# Altium schematic sheet ESP32 with USBC.SchDoc
size A2; SheetNumber: 1; SheetTotal: 1
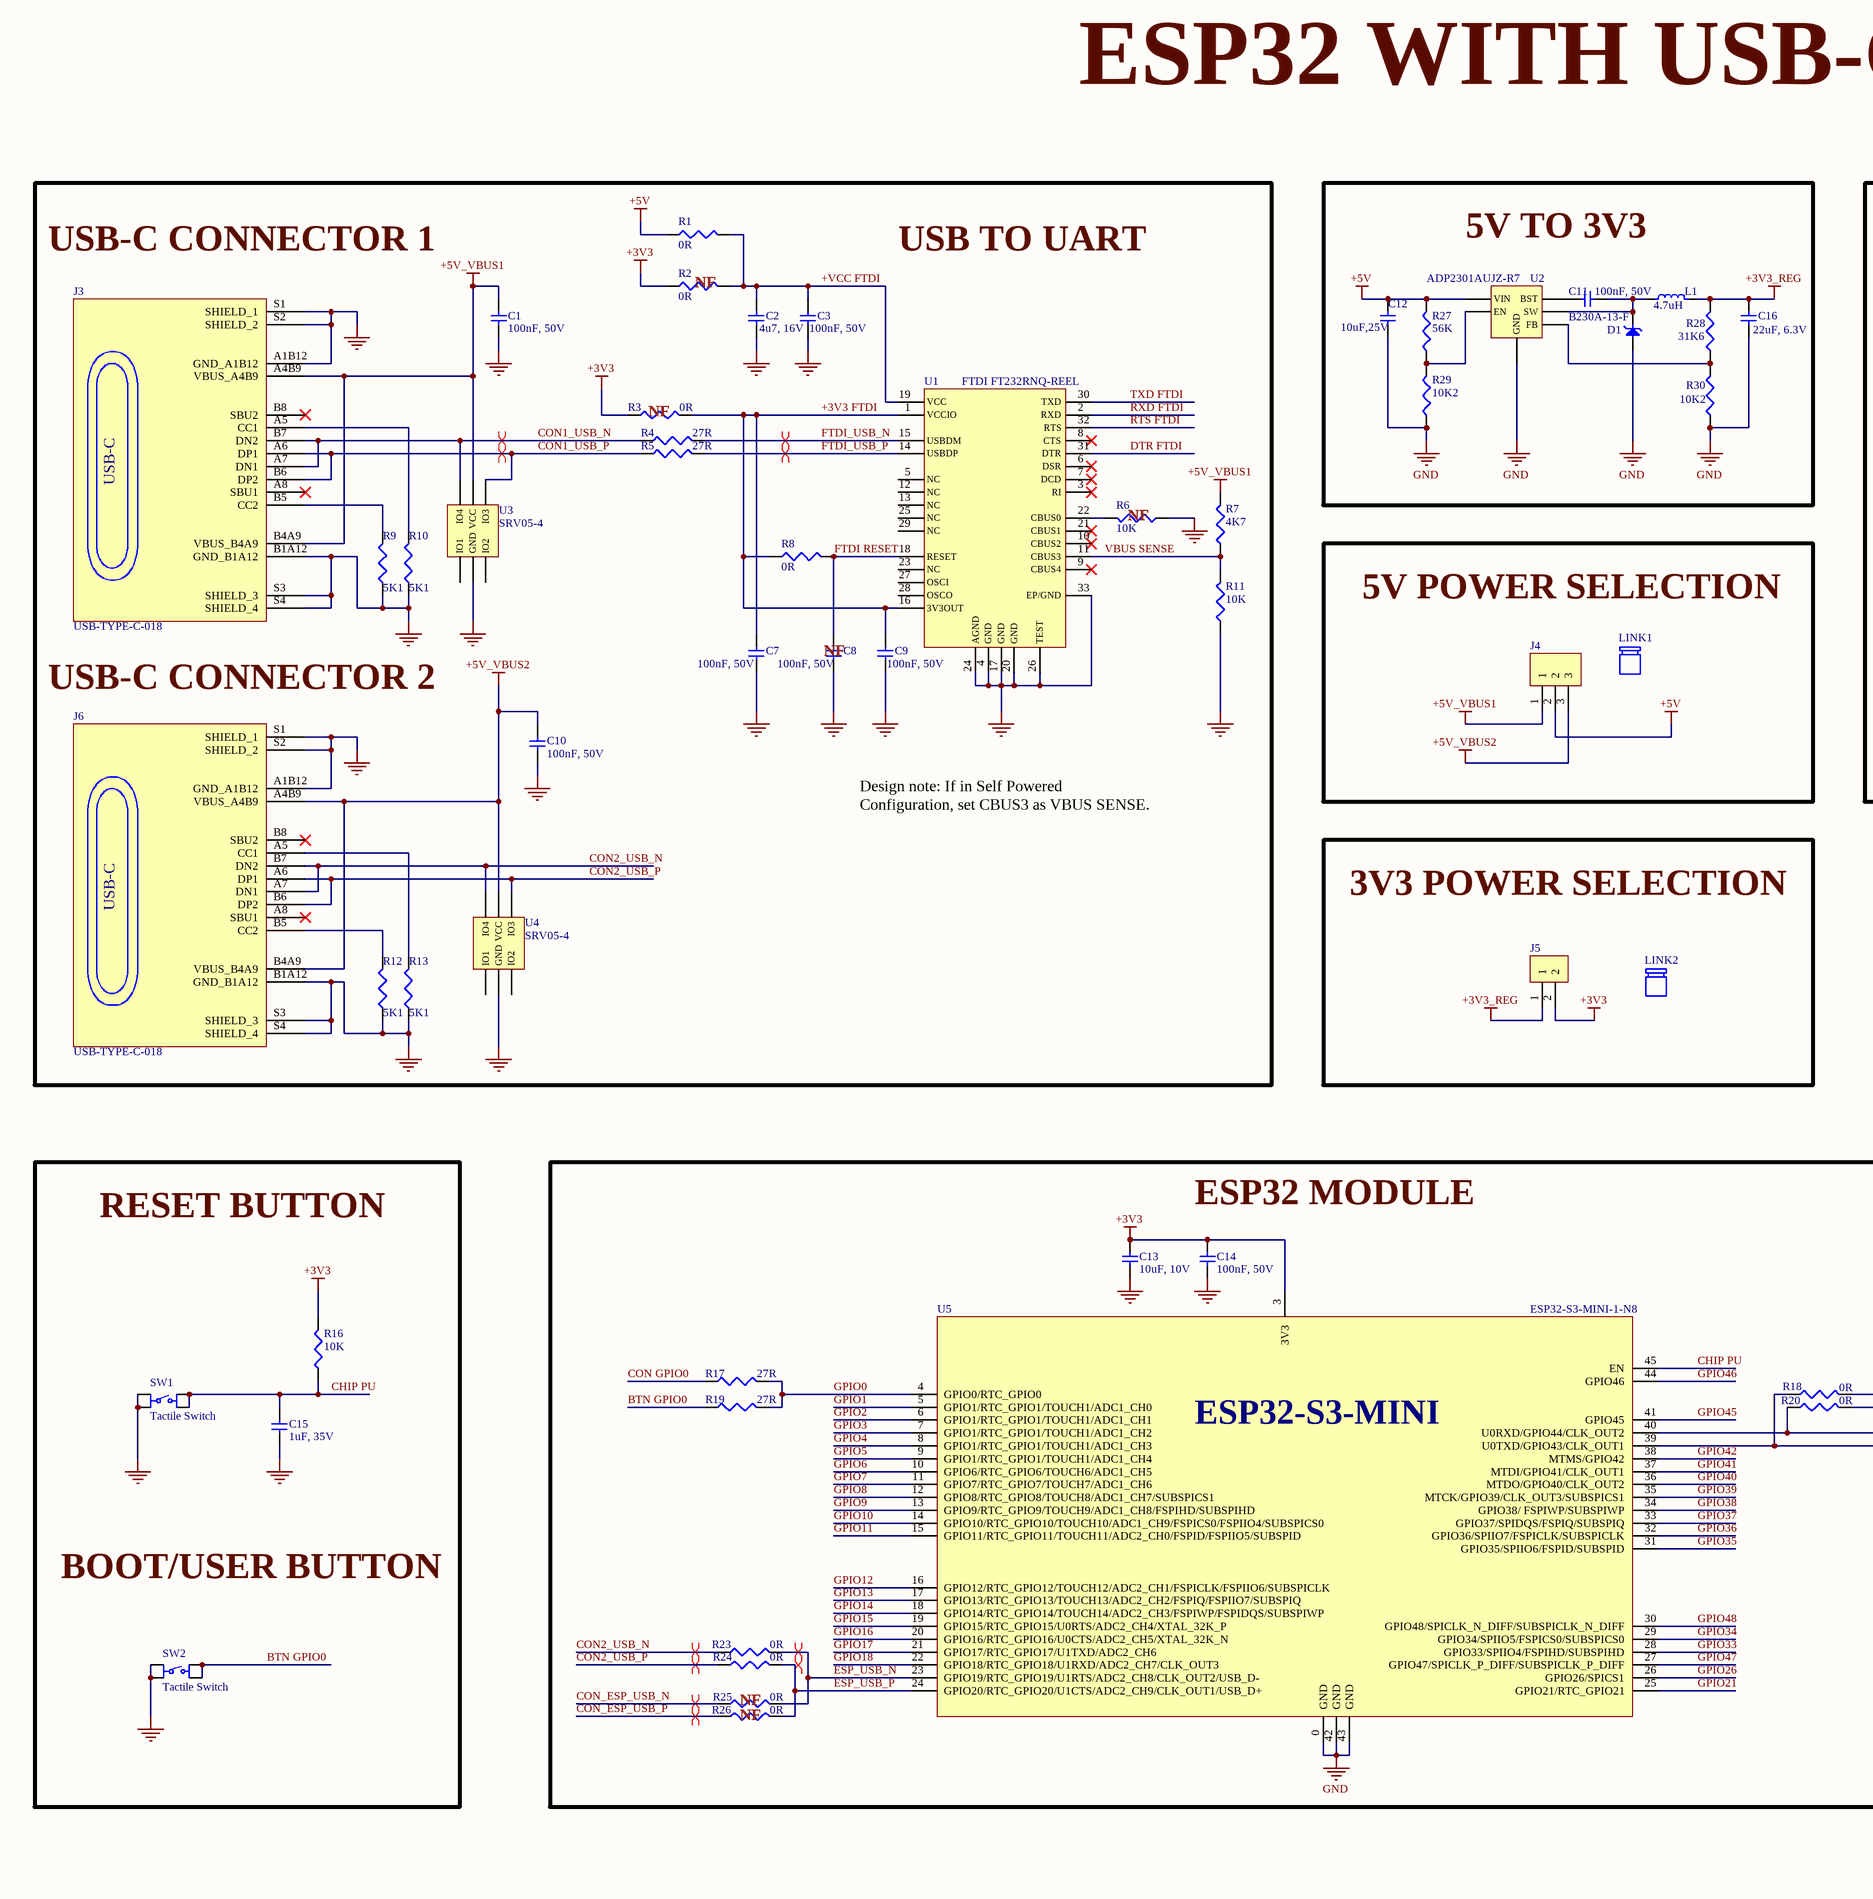
[diagram p0: ESP32 with USBC.SchDoc, left]
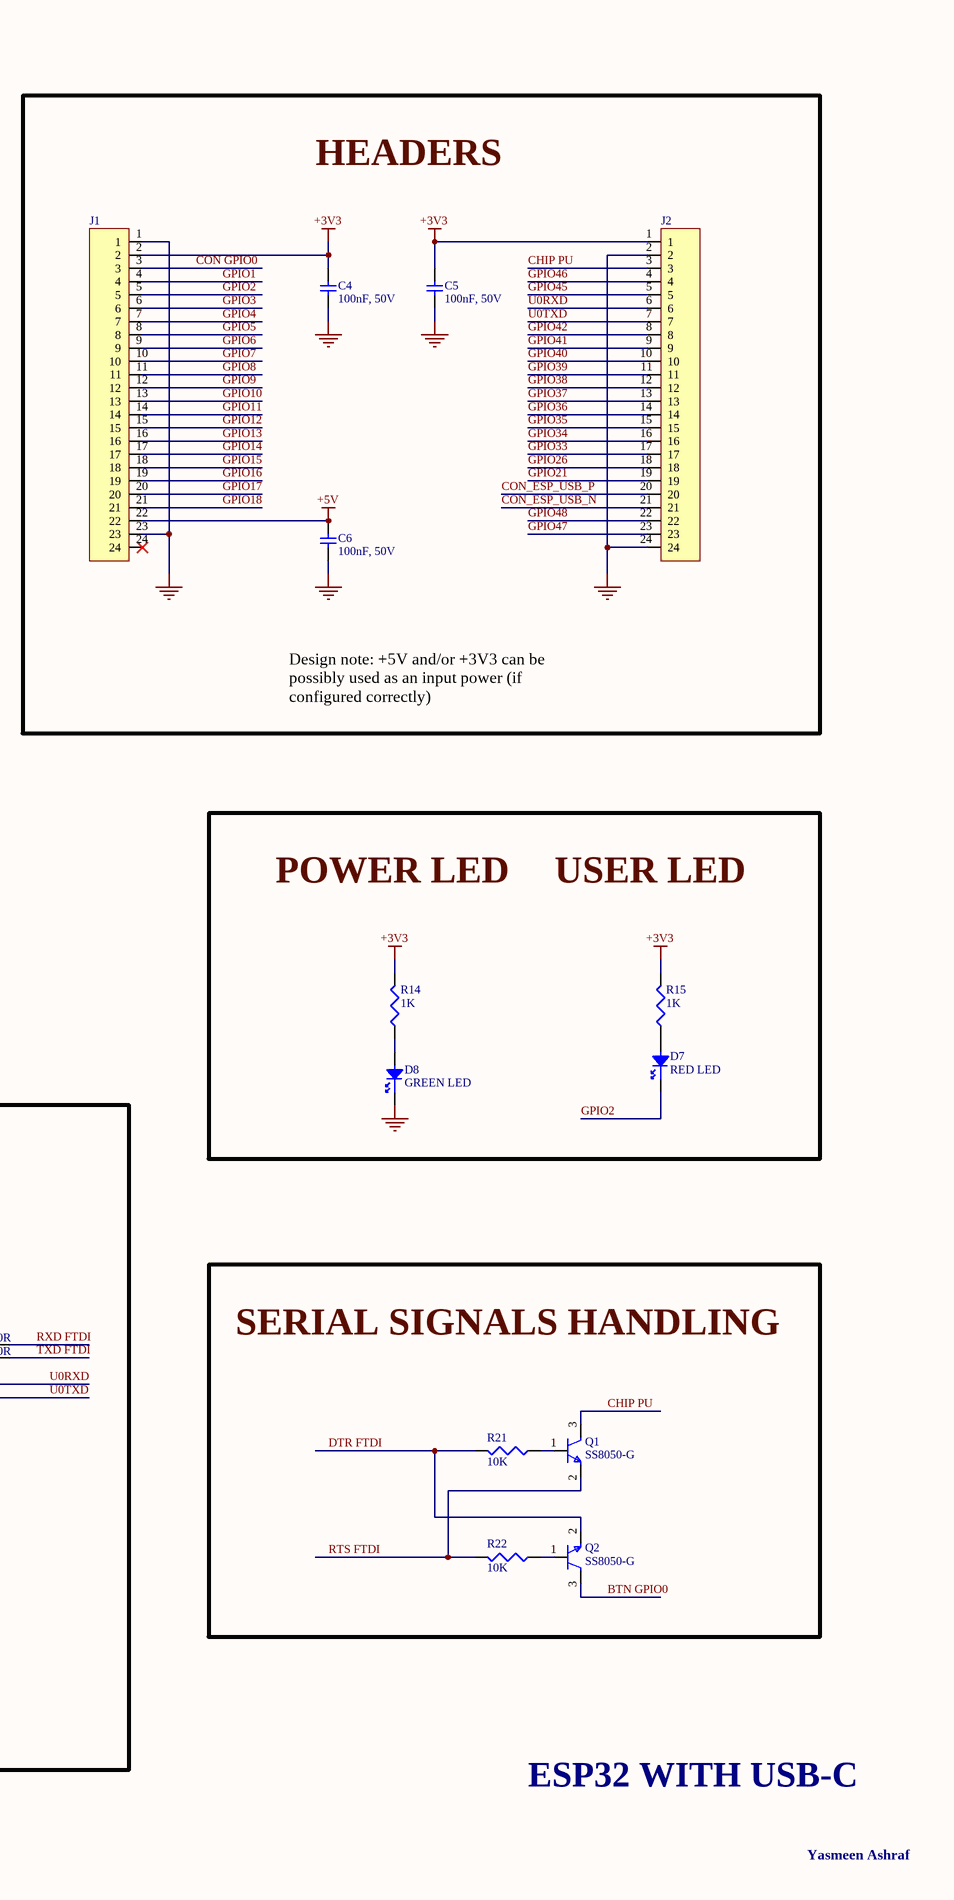
[diagram p1: ESP32 with USBC.SchDoc, right]

## Parts
C1  100nF, 50V  [Capacitor]
C2  4u7, 16V  [Capacitor]
C3  100nF, 50V  [Capacitor]
C4  100nF, 50V  [Capacitor]
C5  100nF, 50V  [Capacitor]
C6  100nF, 50V  [Capacitor]
C7  100nF, 50V  [Capacitor]
C8  100nF, 50V  [Capacitor]
C9  100nF, 50V  [Capacitor]
C10  100nF, 50V  [Capacitor]
C11  100nF, 50V  [Capacitor]
C12  10uF,25V  [CL10A106MA8NRNC]
C13  10uF, 10V  [Capacitor]
C14  100nF, 50V  [Capacitor]
C15  1uF, 35V  [Capacitor]
C16  22uF, 6.3V  [Capacitor]
D1  B230A-13-F  [Schottky Diode]
D7  RED LED  [RED LED]
D8  GREEN LED  [GREEN LED]
J1  X6511WV-24H-C60D30  [HDR_1x24]  (value not drawn)
J2  X6511WV-24H-C60D30  [HDR_1x24]  (value not drawn)
J3  USB-TYPE-C-018  [USB-TYPE-C-018]
J4  TSW-103-14-G-S  [TSW-103-14-G-S]  (value not drawn)
J5  22284020  [HDR_1x2]  (value not drawn)
J6  USB-TYPE-C-018  [USB-TYPE-C-018]
L1  4.7uH  [Inductor]
LINK1  M50-1900005  (value not drawn)  (mechanical)
LINK2  M50-1900005  (value not drawn)  (mechanical)
Q1  SS8050-G  [SS8050-G]
Q2  SS8050-G  [SS8050-G]
R1  0R  [RC0402]
R2  0R  [RC0402]
R3  0R  [RC0402]
R4  27R  [RC0402]
R5  27R  [RC0402]
R6  10K  [AC0402]
R7  4K7  [RC0402]
R8  0R  [RC0402]
R9  5K1  [RC0402]
R10  5K1  [RC0402]
R11  10K  [AC0402]
R12  5K1  [RC0402]
R13  5K1  [RC0402]
R14  1K  [RC0402]
R15  1K  [RC0402]
R16  10K  [AC0402]
R17  27R  [RC0402]
R18  0R  [RC0402]
R19  27R  [RC0402]
R20  0R  [RC0402]
R21  10K  [AC0402]
R22  10K  [AC0402]
R23  0R  [RC0402]
R24  0R  [RC0402]
R25  0R  [RC0402]
R26  0R  [RC0402]
R27  56K  [RC0402]
R28  31K6  [AC0402]
R29  10K2  [RC0402]
R30  10K2  [RC0402]
SW1  Tactile Switch  [Tactile Switch]
SW2  Tactile Switch  [Tactile Switch]
U1  FTDI FT232RNQ-REEL  [FTDI FT232RNQ-REEL]
U2  ADP2301AUJZ-R7  [BUCK]
U3  SRV05-4  [SRV05-4]
U4  SRV05-4  [SRV05-4]
U5  ESP32-S3-MINI-1-N8  [ESP32-S3-MINI-1-N8]

## Blocks framed on the sheet
5V TO 3V3: C11 C12 C16 D1 L1 R27-R30 U2
HEADERS: C4-C6 J1 J2
5V POWER SELECTION: J4 LINK1
3V3 POWER SELECTION: J5 LINK2
ESP32 MODULE: C13 C14 R17-R20 R23-R26 U5
SERIAL SIGNALS HANDLING: Q1 Q2 R21 R22

## Nets
+3V3: C4.2 C5.2 C13.2 C14.2 J1.2 J2.1 J5.2 R2.1 R3.1 R14.2 R15.2 R16.2 U5.3(3V3)
+3V3_REG: C16.2 J5.1 L1.2 R28.2
+5V: C6.2 C12.2 J1.22 J4.2 R1.1 R27.2 U2.5(VIN)
+5V_VBUS1: C1.2 J3.A4B9(VBUS_A4B9) J3.B4A9(VBUS_B4A9) J4.1 R7.2 U3.5(VCC)
+5V_VBUS2: C10.2 J4.3 J6.A4B9(VBUS_A4B9) J6.B4A9(VBUS_B4A9) U4.5(VCC)
GND: C1.1 C2.1 C3.1 C4.1 C5.1 C6.1 C7.1 C8.1 C9.1 C10.1 C12.1 C13.1 C14.1 C15.1 C16.1 D1.A D8.1 J1.1 J1.23 J2.2 J2.24 J3.A1B12(GND_A1B12) J3.B1A12(GND_B1A12) J3.S1(SHIELD_1) J3.S2(SHIELD_2) J3.S3(SHIELD_3) J3.S4(SHIELD_4) J6.A1B12(GND_A1B12) J6.B1A12(GND_B1A12) J6.S1(SHIELD_1) J6.S2(SHIELD_2) J6.S3(SHIELD_3) J6.S4(SHIELD_4) R6.1 R9.1 R10.1 R11.1 R12.1 R13.1 R29.1 R30.1 SW1.3 SW1.4 SW2.3 SW2.4 U1.4(GND) U1.17(GND) U1.20(GND) U1.24(AGND) U1.26(TEST) U1.33(EP/GND) U2.2(GND) U3.2(GND) U4.2(GND) U5.0(GND) U5.42(GND) U5.43(GND)
+3V3 FTDI: C7.2 C9.2 R3.2 R8.1 U1.1(VCCIO) U1.16(3V3OUT)
+VCC FTDI: C2.2 C3.2 R1.2 R2.2 U1.19(VCC)
BTN GPIO0: Q2.3 R19.1 SW2.1 SW2.2
CHIP PU: C15.2 J2.3 Q1.3 R16.1 SW1.1 SW1.2 U5.45(EN)
CON1_USB_N: J3.A7(DN1) J3.B7(DN2) R4.1 U3.6(IO4)
CON1_USB_P: J3.A6(DP1) J3.B6(DP2) R5.1 U3.4(IO3)
CON2_USB_N: J6.A7(DN1) J6.B7(DN2) R23.1 U4.6(IO4)
CON2_USB_P: J6.A6(DP1) J6.B6(DP2) R24.1 U4.4(IO3)
CON GPIO0: J1.3 R17.1
CON_ESP_USB_N: J2.21 R25.1
CON_ESP_USB_P: J2.20 R26.1
DTR FTDI: Q2.2 R21.2 U1.31(DTR)
ESP_USB_N: R23.2 R25.2 U5.23(GPIO19/RTC_GPIO19/U1RTS/ADC2_CH8/CLK_OUT2/USB_D-)
ESP_USB_P: R24.2 R26.2 U5.24(GPIO20/RTC_GPIO20/U1CTS/ADC2_CH9/CLK_OUT1/USB_D+)
FTDI RESET: C8.2 R8.2 U1.18(RESET)
FTDI_USB_N: R4.2 U1.15(USBDM)
FTDI_USB_P: R5.2 U1.14(USBDP)
GPIO0: R17.2 R19.2 U5.4(GPIO0/RTC_GPIO0)
GPIO1: J1.4 U5.5(GPIO1/RTC_GPIO1/TOUCH1/ADC1_CH0)
GPIO2: D7.1 J1.5 U5.6(GPIO1/RTC_GPIO1/TOUCH1/ADC1_CH1)
GPIO3: J1.6 U5.7(GPIO1/RTC_GPIO1/TOUCH1/ADC1_CH2)
GPIO4: J1.7 U5.8(GPIO1/RTC_GPIO1/TOUCH1/ADC1_CH3)
GPIO5: J1.8 U5.9(GPIO1/RTC_GPIO1/TOUCH1/ADC1_CH4)
GPIO6: J1.9 U5.10(GPIO6/RTC_GPIO6/TOUCH6/ADC1_CH5)
GPIO7: J1.10 U5.11(GPIO7/RTC_GPIO7/TOUCH7/ADC1_CH6)
GPIO8: J1.11 U5.12(GPIO8/RTC_GPIO8/TOUCH8/ADC1_CH7/SUBSPICS1)
GPIO9: J1.12 U5.13(GPIO9/RTC_GPIO9/TOUCH9/ADC1_CH8/FSPIHD/SUBSPIHD)
GPIO10: J1.13 U5.14(GPIO10/RTC_GPIO10/TOUCH10/ADC1_CH9/FSPICS0/FSPIIO4/SUBSPICS0)
GPIO11: J1.14 U5.15(GPIO11/RTC_GPIO11/TOUCH11/ADC2_CH0/FSPID/FSPIIO5/SUBSPID)
GPIO12: J1.15 U5.16(GPIO12/RTC_GPIO12/TOUCH12/ADC2_CH1/FSPICLK/FSPIIO6/SUBSPICLK)
GPIO13: J1.16 U5.17(GPIO13/RTC_GPIO13/TOUCH13/ADC2_CH2/FSPIQ/FSPIIO7/SUBSPIQ)
GPIO14: J1.17 U5.18(GPIO14/RTC_GPIO14/TOUCH14/ADC2_CH3/FSPIWP/FSPIDQS/SUBSPIWP)
GPIO15: J1.18 U5.19(GPIO15/RTC_GPIO15/U0RTS/ADC2_CH4/XTAL_32K_P)
GPIO16: J1.19 U5.20(GPIO16/RTC_GPIO16/U0CTS/ADC2_CH5/XTAL_32K_N)
GPIO17: J1.20 U5.21(GPIO17/RTC_GPIO17/U1TXD/ADC2_CH6)
GPIO18: J1.21 U5.22(GPIO18/RTC_GPIO18/U1RXD/ADC2_CH7/CLK_OUT3)
GPIO21: J2.19 U5.25(GPIO21/RTC_GPIO21)
GPIO26: J2.18 U5.26(GPIO26/SPICS1)
GPIO33: J2.17 U5.28(GPIO33/SPIIO4/FSPIHD/SUBSPIHD)
GPIO34: J2.16 U5.29(GPIO34/SPIIO5/FSPICS0/SUBSPICS0)
GPIO35: J2.15 U5.31(GPIO35/SPIIO6/FSPID/SUBSPID)
GPIO36: J2.14 U5.32(GPIO36/SPIIO7/FSPICLK/SUBSPICLK)
GPIO37: J2.13 U5.33(GPIO37/SPIDQS/FSPIQ/SUBSPIQ)
GPIO38: J2.12 U5.34(GPIO38/_FSPIWP/SUBSPIWP)
GPIO39: J2.11 U5.35(MTCK/GPIO39/CLK_OUT3/SUBSPICS1)
GPIO40: J2.10 U5.36(MTDO/GPIO40/CLK_OUT2)
GPIO41: J2.9 U5.37(MTDI/GPIO41/CLK_OUT1)
GPIO42: J2.8 U5.38(MTMS/GPIO42)
GPIO45: J2.5 U5.41(GPIO45)
GPIO46: J2.4 U5.44(GPIO46)
GPIO47: J2.23 U5.27(GPIO47/SPICLK_P_DIFF/SUBSPICLK_P_DIFF)
GPIO48: J2.22 U5.30(GPIO48/SPICLK_N_DIFF/SUBSPICLK_N_DIFF)
RTS FTDI: Q1.2 R22.2 U1.32(RTS)
RXD FTDI: R18.2 U1.2(RXD)
TXD FTDI: R20.2 U1.30(TXD)
U0RXD: J2.6 R20.1 U5.40(U0RXD/GPIO44/CLK_OUT2)
U0TXD: J2.7 R18.1 U5.39(U0TXD/GPIO43/CLK_OUT1)
VBUS SENSE: R7.1 R11.2 U1.11(CBUS3)
NetC11_1: C11.1 D1.K L1.1 U2.6(SW)
NetC11_2: C11.2 U2.1(BST)
NetD7_2: D7.2 R15.1
NetD8_2: D8.2 R14.1
NetJ3_A5: J3.A5(CC1) R10.2
NetJ3_B5: J3.B5(CC2) R9.2
NetJ6_A5: J6.A5(CC1) R13.2
NetJ6_B5: J6.B5(CC2) R12.2
NetQ1_1: Q1.1 R21.1
NetQ2_1: Q2.1 R22.1
NetR6_2: R6.2 U1.22(CBUS0)
NetR27_1: R27.1 R29.2 U2.4(EN)
NetR28_1: R28.1 R30.2 U2.3(FB)

Not connected (* = marked no-connect by the designer): J1 24*; J3 A8(SBU1)* B8(SBU2)*; J6 A8(SBU1)* B8(SBU2)*; U1 3(RI)* 5(NC) 6(DSR)* 7(DCD)* 8(CTS)* 9(CBUS4)* 10(CBUS2)* 12(NC) 13(NC) 21(CBUS1)* 23(NC) 25(NC) 27(OSCI) 28(OSCO) 29(NC); U3 1(IO1) 3(IO2); U4 1(IO1) 3(IO2)

## Layout directives
differential pair; differential pair class DIFF90: CON2_USB_N, CON2_USB_P, CON_ESP_USB_N, CON_ESP_USB_P, ESP_USB_N, ESP_USB_P
differential pair: CON1_USB_N, CON1_USB_P, FTDI_USB_N, FTDI_USB_P

## Notes on the sheet
- ESP32 WITH USB-C
- USB-C CONNECTOR 1
- (near R2) NF
- USB TO UART
- (near R3) NF
- (near R6) NF
- (near C8) NF
- USB-C CONNECTOR 2
- Design note: +5V and/or +3V3 can be possibly used as an input power (if configured correctly)
- Design note: If in Self Powered Configuration, set CBUS3 as VBUS SENSE.
- POWER LED
- USER LED
- RESET BUTTON
- BOOT/USER BUTTON
- (near R25) NF
- NF
- Yasmeen Ashraf
- (in symbol ESP32-S3-MINI-1-N8) ESP32-S3-MINI
- (in symbol USB-TYPE-C-018) USB-C

## Library data of the parts
C1 C3-C11 C14 = CL05B104KB54PNC: 50V 100nF X7R ±10% 0402 Multilayer Ceramic Capacitors MLCC - SMD/SMT ROHS; Manufacturer: Samsung; Manufacturer Part Number: CL05B104KB54PNC; Supplier: LCSC; Supplier Part Number: C307331
C2 = CL05A475MO5NUNC: 16V 4.7uF X5R ±20% 0402 Multilayer Ceramic Capacitors MLCC - SMD/SMT ROHS; Manufacturer: Samsung Electro-Mechanics; Manufacturer Part Number: CL05A475MO5NUNC; Supplier: LCSC; Supplier Name: C318563
C12 = CL10A106MA8NRNC: 25V 10uF X5R ±20% 0603 Multilayer Ceramic Capacitors MLCC - SMD/SMT ROHS; Manufacturer: Samsung Electro-Mechanics; Manufacturer Part Number: CL10A106MA8NRNC; Supplier: LCSC; Supplier Part Number: C96446
C13 = CL05A106MP8NUB8: 10V 10uF X5R ±20% 0402 Multilayer Ceramic Capacitors MLCC - SMD/SMT ROHS; Manufacturer: Samsung; Manufacturer Part Number: CL05A106MP8NUB8; Supplier: LCSC; Supplier Name: C307415
C15 = CL05A105KL5NRNC: 35V 1uF X5R ±10% 0402 Multilayer Ceramic Capacitors MLCC - SMD/SMT ROHS; Manufacturer: Samsung; Manufacturer Part Number: CL05A105KL5NRNC; Supplier: LCSC; Supplier Part Number: C307413
C16 = CL05A226MQ5QUNC: 6.3V 22uF X5R ±20% 0402 Multilayer Ceramic Capacitors MLCC - SMD/SMT ROHS; Manufacturer: Samsung Electro-Mechanics; Manufacturer Part Number: CL05A226MQ5QUNC; Supplier: LCSC; Supplier Name: C105226
D1 = B230A-13-F: 30V 500mV@2A 2A SMA(DO-214AC) Schottky Diodes ROHS; Manufacturer: Diodes Incorporated; Manufacturer Part Number: B230A-13-F; Supplier: LCSC; Supplier Part Number: C12889
D7 = VLMS1500-GS08: 20mA 54mcd -30℃~+85℃ 631nm Red 130° 75mW 2V 0402 LED Indication - Discrete ROHS; Manufacture Name: Vishay Intertech; Manufacture Part Number: VLMS1500-GS08; Supplier: LCSC; Supplier Part Number: C511370
D8 = VLMG1500-GS08: 20mA 35mcd 571nm Yellow Green 130° 2V 0402 LED Indication - Discrete ROHS; Manufacture Name: Vishay Intertech; Manufacture Part Number: VLMG1500-GS08; Supplier: LCSC; Supplier Part Number: C511404
J1 J2 = X6511WV-24H-C60D30: Gold 250V 3A Policy 2.5mm 24P 260℃ -40℃~+105℃ 2.54mm Single Row Black Brass 2.54mm 1x24P Plugin,P=2.54mm Pin Headers ROHS; Manufacture Name: XKB Connection; Manufacture Part Number: X6511WV-24H-C60D30; Supplier: LCSC; Supplier Part Number: C725956
J3 J6 = USB-TYPE-C-018: 3A 1 Horizontal attachment 16P Female -25℃~+85℃ Type-C SMD USB Connectors ROHS; Manufacture Name: DEALON; Manufacture Part Number: USB-TYPE-C-018; Supplier Part Number: C2927038; Supplier Name: LCSC
J4 = TSW-103-14-G-S: Gold Direct Insert 3P -55℃~+125℃ 2.54mm Black Single Row Phosphor Bronze Plugin,P=2.54mm Pin Headers ROHS; Manufacturer: Samtec; Manufacturer Part Number: TSW-103-14-G-S; Supplier: LCSC; Supplier Part Number: C7365843
J5 = 22284020: Direct Insert Policy 2P 2.54mm Single Row Black Brass 1x2P Plugin,P=2.54mm Pin Headers ROHS; Manufacture Name: MOLEX; Manufacture Part Number: 22284020; Supplier: LCSC; Supplier Part Number: C234182
L1 = LQH5BPZ4R7NT0L: 2A 4.7uH ±30% 3A SMD,5x5mm Inductors (SMD) ROHS; Manufacturer: Murata Electronics; Manufacturer Part Number: LQH5BPZ4R7NT0L; Supplier: LCSC; Supplier Name: C703747
LINK1 LINK2 = M50-1900005: 1.27mm (0.05") Pitch Closed Top Jumper Socket, black, gold; Manufacturer: Harwin; Manufacturer Part Number: M50-1900005; Supplier: LCSC; Supplier Part Number: C6293276
Q1 Q2 = SS8050-G: 25V 300mW 120@100mA,1V 1.5A NPN SOT-23 Bipolar (BJT) ROHS; Manufacture Name: Jiangsu Changjing Electronics Technology Co., Ltd.; Manufacture Part Number: SS8050-G(RANGE:120-200); Supplier: LCSC; Supplier Part Number: C164886
R1-R3 R8 R18 R20 R23-R26 = RC0402JR-070RL: 62.5mW Thick Film Resistors 50V ±5% 0Ω 0402 Chip Resistor - Surface Mount ROHS; Manufacturer: YAGEO; Manufacturer Part Number: RC0402JR-070RL; Supplier: LCSC; Supplier Part Number: C60485
R4 R5 R17 R19 = RC0402FR-0727RL: 62.5mW Thick Film Resistors 50V ±100ppm/℃ ±1% 27Ω 0402 Chip Resistor - Surface Mount ROHS; Manufacturer: Yageo; Manufacturer Part Number: RC0402FR-0727RL; Supplier: LCSC; Supplier Part Number: C138021
R6 R11 R16 R21 R22 = AC0402FR-0710KL: 62.5mW Thick Film Resistors 50V ±100ppm/℃ ±1% 10kΩ 0402 Chip Resistor - Surface Mount ROHS; Manufacturer: Yageo; Manufacturer Part Number: AC0402FR-0710KL; Supplier: LCSC; Supplier Part Number: C144807
R7 = RC0402FR-074K7L: 62.5mW Thick Film Resistors 50V ±100ppm/℃ ±1% 4.7kΩ 0402 Chip Resistor - Surface Mount ROHS; Manufacturer: YAGEO; Manufacturer Part Number: RC0402FR-074K7L; Supplier: LCSC; Supplier Name: C105871
R9 R10 R12 R13 = RC0402FR-075K1L: 62.5mW Thick Film Resistors 50V ±100ppm/℃ ±1% 5.1kΩ 0402 Chip Resistor - Surface Mount ROHS; Manufacturer: Yageo; Manufacturer Part Number: RC0402FR-075K1L; Supplier: LCSC; Supplier Part Number: C105872
R14 R15 = RC0402FR-071KL: 62.5mW Thick Film Resistors 50V ±100ppm/℃ ±1% 1kΩ 0402 Chip Resistor - Surface Mount ROHS; Manufacturer: YAGEO; Manufacturer Part Number: RC0402FR-071KL; Supplier: LCSC; Supplier Part Number: C106235
R27 = RC0402FR-0756KL: 62.5mW Thick Film Resistors 50V ±100ppm/℃ ±1% 56kΩ 0402 Chip Resistor - Surface Mount ROHS; Manufacturer: YAGEO; Manufacturer Part Number: RC0402FR-0756KL; Supplier: LCSC; Supplier Part Number: C114756
R28 = AC0402FR-0731K6L: 62.5mW Thick Film Resistors 50V ±100ppm/℃ ±1% 31.6kΩ 0402 Chip Resistor - Surface Mount ROHS; Manufacturer: YAGEO; Manufacturer Part Number: AC0402FR-0731K6L; Supplier: LCSC; Supplier Part Number: C226989
R29 R30 = RC0402FR-0710K2L: 62.5mW Thick Film Resistors 50V ±100ppm/℃ ±1% 10.2kΩ 0402 Chip Resistor - Surface Mount ROHS; Manufacturer: YAGEO; Manufacturer Part Number: RC0402FR-0710K2L; Supplier: LCSC; Supplier Part Number: C138069
SW1 SW2 = Tactile Switch: 5.2mm 1.5mm Round Button 20mA Standing paste 5.2mm SPST 160gf 15V SMD,5.2x5.2mm Tactile Switches ROHS; Manufacture Name: C&K; Manufacture Part Number: PTS525SM15SMTR2LFS; Supplier: LCSC; Supplier Part Number: C221856
U1 = FTDI FT232RNQ-REEL: USB to UART QFN-32(5x5) USB Converters ROHS; Manufacturer: FTDI; Manufacturer Part Number: FT232RNQ-REEL; Supplier: LCSC; Supplier Name: C5441431
U2 = ADP2301AUJZ-R7: Step-down type Adjustable 800mV~17V 1.2A 3V~20V TSOT-6 DC-DC Converters ROHS; Manufacturer: Analog Devices; Manufacturer Part Number: ADP2301AUJZ-R7; Supplier: LCSC; Supplier Part Number: C143872
U3 U4 = SRV05-4: 15V 60W 9V 5V SOT-23-6 ESD and Surge Protection (TVS/ESD) ROHS; Manufacture Name: MSKSEMI; Manufacture Part Number: SRV05-4; Supplier: LCSC; Supplier Part Number: C2836319
U5 = ESP32-S3-MINI-1-N8: SMD module, ESP32-S3FN8, 8 MB SPI flash, PCB antenna; Manufacturer: Espressif Systems; Manufacturer Part Number: ESP32-S3-MINI-1-N8; Supplier: LCSC; Supplier Part Number: C2913206